# Altium schematic sheet ECGAcquisition.SchDoc
size B
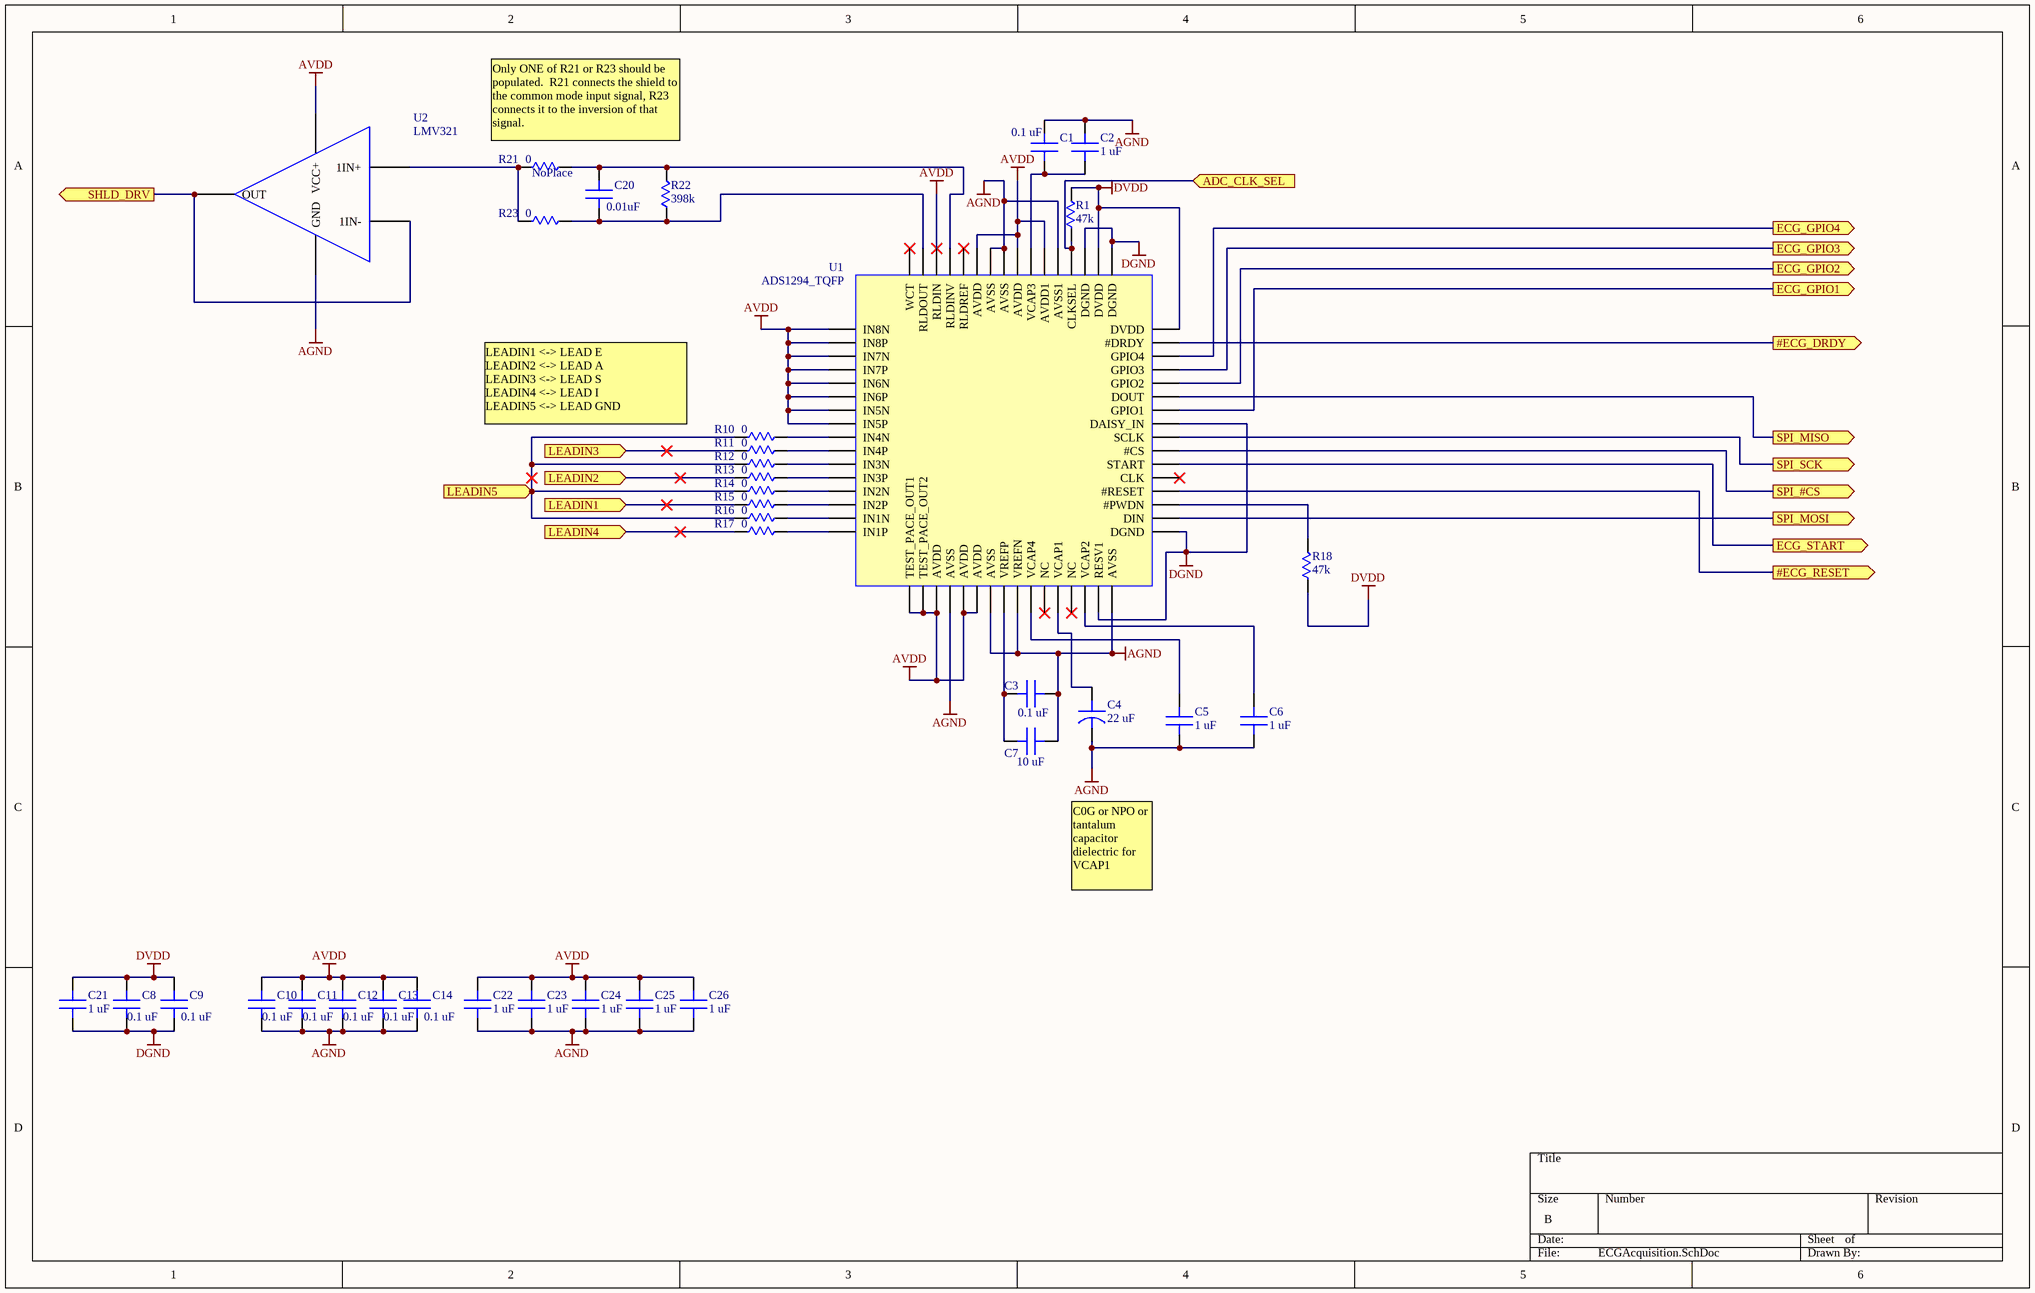
[diagram p0: ECGAcquisition.SchDoc]

## Parts
C1  value 0.1 uF  [CAP_0603]  (hidden comment: CAP_GEN)
C2  value 1 uF  [CAP_0603]  (hidden comment: CAP_GEN)
C3  value 0.1 uF  [CAP_0603]  (hidden comment: CAP_GEN)
C4  value 22 uF  [CAP_0603_POLAR]  (hidden comment: CAP_GEN_POLAR)
C5  value 1 uF  [CAP_0603]  (hidden comment: CAP_GEN)
C6  value 1 uF  [CAP_0603]  (hidden comment: CAP_GEN)
C7  value 10 uF  [CAP_0603]  (hidden comment: CAP_GEN)
C8  value 0.1 uF  [CAP_0603]  (hidden comment: CAP_GEN)
C9  value 0.1 uF  [CAP_0603]  (hidden comment: CAP_GEN)
C10  value 0.1 uF  [CAP_0603]  (hidden comment: CAP_GEN)
C11  value 0.1 uF  [CAP_0603]  (hidden comment: CAP_GEN)
C12  value 0.1 uF  [CAP_0603]  (hidden comment: CAP_GEN)
C13  value 0.1 uF  [CAP_0603]  (hidden comment: CAP_GEN)
C14  value 0.1 uF  [CAP_0603]  (hidden comment: CAP_GEN)
C20  value 0.01uF  [CAP_0603]  (hidden comment: CAP_GEN)
C21  value 1 uF  [CAP_0603]  (hidden comment: CAP_GEN)
C22  value 1 uF  [CAP_0603]  (hidden comment: CAP_GEN)
C23  value 1 uF  [CAP_0603]  (hidden comment: CAP_GEN)
C24  value 1 uF  [CAP_0603]  (hidden comment: CAP_GEN)
C25  value 1 uF  [CAP_0603]  (hidden comment: CAP_GEN)
C26  value 1 uF  [CAP_0603]  (hidden comment: CAP_GEN)
R1  value 47k  [RES_0603]  (hidden comment: RES_GEN)
R10  value 0  [RES_0603]  (hidden comment: RES_GEN)
R11  value 0  [RES_0603]  (hidden comment: RES_GEN)
R12  value 0  [RES_0603]  (hidden comment: RES_GEN)
R13  value 0  [RES_0603]  (hidden comment: RES_GEN)
R14  value 0  [RES_0603]  (hidden comment: RES_GEN)
R15  value 0  [RES_0603]  (hidden comment: RES_GEN)
R16  value 0  [RES_0603]  (hidden comment: RES_GEN)
R17  value 0  [RES_0603]  (hidden comment: RES_GEN)
R18  value 47k  [RES_0603]  (hidden comment: RES_GEN)
R21  value 0  NoPlace?: NoPlace  [RES_0603]  (hidden comment: RES_GEN)
R22  value 398k  [RES_0603]  (hidden comment: RES_GEN)
R23  value 0  [RES_0603]  (hidden comment: RES_GEN)
U1  ADS1294_TQFP  [TQFP_64_HD]
U2  LMV321  [SOT23_5]

## Ports
#ECG_DRDY (out), #ECG_RESET (out), ADC_CLK_SEL (in), ECG_GPIO1 (out), ECG_GPIO2 (out), ECG_GPIO3 (out), ECG_GPIO4 (out), ECG_START (out), LEADIN1 (in), LEADIN2 (in), LEADIN3 (in), LEADIN4 (in), LEADIN5 (in), SHLD_DRV (out), SPI_#CS (out), SPI_MISO (out), SPI_MOSI (out), SPI_SCK (out)

## Nets
AGND: C1.2 C2.2 C3.1 C4.2 C5.1 C6.1 C7.1 C10.1 C11.1 C12.1 C13.1 C14.1 C22.1 C23.1 C24.1 C25.1 C26.1 U1.20(AVSS) U1.23(AVSS) U1.25(VREFN) U1.32(AVSS) U1.53(AVSS1) U1.57(AVSS) U1.58(AVSS) U2.2(GND)
AVDD: C10.2 C11.2 C12.2 C13.2 C14.2 C22.2 C23.2 C24.2 C25.2 C26.2 U1.1(IN8N) U1.2(IN8P) U1.3(IN7N) U1.4(IN7P) U1.5(IN6N) U1.6(IN6P) U1.7(IN5N) U1.8(IN5P) U1.17(TEST_PACE_OUT1) U1.18(TEST_PACE_OUT2) U1.19(AVDD) U1.21(AVDD) U1.22(AVDD) U1.54(AVDD1) U1.56(AVDD) U1.59(AVDD) U1.62(RLDIN) U2.5(VCC+)
DGND: C8.1 C9.1 C21.1 U1.31(RESV1) U1.33(DGND) U1.41(DAISY_IN) U1.49(DGND) U1.51(DGND)
DVDD: C8.2 C9.2 C21.2 R1.2 R18.1 U1.48(DVDD) U1.50(DVDD)
#ECG_DRDY: U1.47(#DRDY) ; port #ECG_DRDY
#ECG_RESET: U1.36(#RESET) ; port #ECG_RESET
ADC_CLK_SEL: R1.1 U1.52(CLKSEL) ; port ADC_CLK_SEL
ECG_GPIO1: U1.42(GPIO1) ; port ECG_GPIO1
ECG_GPIO2: U1.44(GPIO2) ; port ECG_GPIO2
ECG_GPIO3: U1.45(GPIO3) ; port ECG_GPIO3
ECG_GPIO4: U1.46(GPIO4) ; port ECG_GPIO4
ECG_START: U1.38(START) ; port ECG_START
LEADIN1: R15.1 ; port LEADIN1
LEADIN2: R13.1 ; port LEADIN2
LEADIN3: R11.1 ; port LEADIN3
LEADIN4: R17.1 ; port LEADIN4
LEADIN5: R10.1 R12.1 R14.1 R16.1 ; port LEADIN5
SHLD_DRV: U2.3(1IN-) U2.4(OUT) ; port SHLD_DRV
SPI_#CS: U1.39(#CS) ; port SPI_#CS
SPI_MISO: U1.43(DOUT) ; port SPI_MISO
SPI_MOSI: U1.34(DIN) ; port SPI_MOSI
SPI_SCK: U1.40(SCLK) ; port SPI_SCK
NetC1_1: C1.1 C2.1 U1.55(VCAP3)
NetC3_2: C3.2 C7.2 U1.24(VREFP)
NetC4_1: C4.1 U1.28(VCAP1)
NetC5_2: C5.2 U1.26(VCAP4)
NetC6_2: C6.2 U1.30(VCAP2)
NetC20_1: C20.1 R22.1 R23.2 U1.63(RLDOUT)
NetC20_2: C20.2 R21.2 R22.2 U1.61(RLDINV)
NetR10_2: R10.2 U1.9(IN4N)
NetR11_2: R11.2 U1.10(IN4P)
NetR12_2: R12.2 U1.11(IN3N)
NetR13_2: R13.2 U1.12(IN3P)
NetR14_2: R14.2 U1.13(IN2N)
NetR15_2: R15.2 U1.14(IN2P)
NetR16_2: R16.2 U1.15(IN1N)
NetR17_2: R17.2 U1.16(IN1P)
NetR18_2: R18.2 U1.35(#PWDN)
NetR21_1: R21.1 R23.1 U2.1(1IN+)

Not connected (* = marked no-connect by the designer): U1 27(NC)* 29(NC)* 37(CLK)* 60(RLDREF)* 64(WCT)*

## Notes on the sheet
- Only ONE of R21 or R23 should be populated.  R21 connects the shield to the common mode input signal, R23 connects it to the inversion of that signal.
- LEADIN1 <-> LEAD E
  LEADIN2 <-> LEAD A
  LEADIN3 <-> LEAD S
  LEADIN4 <-> LEAD I
  LEADIN5 <-> LEAD GND
- C0G or NPO or tantalum capacitor dielectric for VCAP1

## Library data of the parts
C1 C3 C8-C14 = CAP_GEN: Generic Capacitor; Manufacturer: Yageo; Manufacturer Part Number: CC0603ZRY5V9BB104
C2 C5 C6 = CAP_GEN: CAP CER 1UF 10V Y5V 0603; Manufacturer: TDK Corporation; Manufacturer Part Number: C1608Y5V1A105Z
C4 = CAP_GEN_POLAR: CAP TANT 22UF 6.3V 20% 0603; Manufacturer: Nichicon; Manufacturer Part Number: F980J226MMA
C7 = CAP_GEN: CAP CER 10UF 6.3V 20% X5R 0603; Manufacturer: Yageo; Manufacturer Part Number: CC0603MRX5R5BB106
C20 = CAP_GEN: CAP CER 10000PF 50V 10% X7R 0603; Manufacturer: TDK Corporation; Manufacturer Part Number: C1608X7R1H103K080AA
C21-C26 = CAP_GEN: CAP CER 1UF 10V 10% X5R 0603; Manufacturer: TDK Corporation; Manufacturer Part Number: C1608X5R1A105K080AC
R1 R18 = RES_GEN: RES 47K OHM 1/10W 5% 0603 SMD; Manufacturer: Yageo; Manufacturer Part Number: RC0603JR-0747KL
R10-R17 R21 R23 = RES_GEN: RES 0.0 OHM 0.1W JUMPER 0603 SMD; Manufacturer: Bourns Inc; Manufacturer Part Number: CR0603-J/-000ELF
R22 = RES_GEN: Generic Resistor; Manufacturer: ?; Manufacturer Part Number: ?
U1 = ADS1294_TQFP: IC AFE 24BIT 32KSPS 4CH 64TQFP; Manufacturer: Texas Instruments; Manufacturer Part Number: ADS1294IPAG
U2 = LMV321: IC OPAMP GP R-R 1MHZ SGL SOT23-5; Manufacturer: Texas Instruments; Manufacturer Part Number: LMV321IDBVR